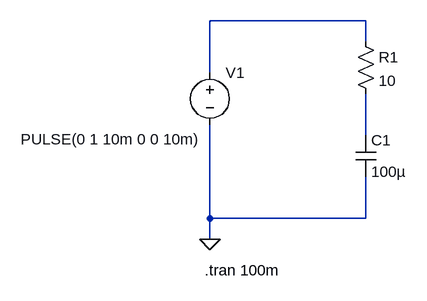
[diagram p0: schematic s-311_2.asc]
s-311_2.asc, the LTspice schematic file:
Version 4
SHEET 1 880 680
WIRE 304 48 64 48
WIRE 304 80 304 48
WIRE 64 128 64 48
WIRE 304 224 304 160
WIRE 64 352 64 208
WIRE 304 352 304 288
WIRE 304 352 64 352
WIRE 64 384 64 352
FLAG 64 384 0
SYMBOL voltage 64 112 R0
WINDOW 3 -291 118 Left 2
WINDOW 123 0 0 Left 0
WINDOW 39 0 0 Left 0
SYMATTR InstName V1
SYMATTR Value PULSE(0 1 10m 0 0 10m)
SYMBOL res 288 64 R0
SYMATTR InstName R1
SYMATTR Value 10
SYMBOL cap 288 224 R0
SYMATTR InstName C1
SYMATTR Value 100µ
TEXT 56 432 Left 2 !.tran 100m

The netlist it stands for:
* s-311_2.asc
V1 N001 0 PULSE(0 1 10m 0 0 10m)
R1 N001 N002 10
C1 N002 0 100µ
.tran 100m
.backanno
.end

* Results of the author's LTspice run, read from the files saved beside the schematic
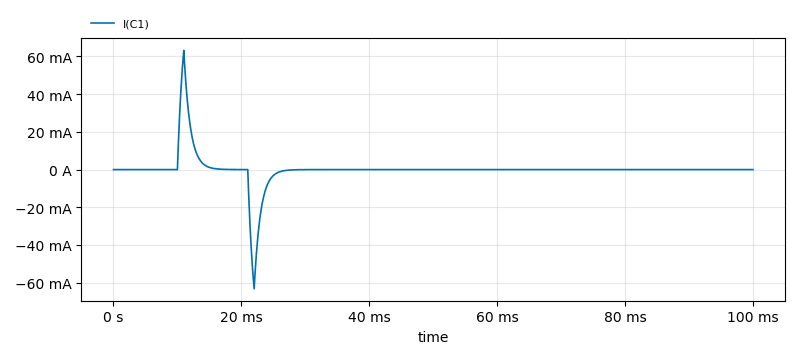
[diagram p1: Transient Analysis of s-311_2.asc, plotted from the saved traces]
* Transient Analysis, 1 run:
*   I(C1): min -63.23 mA, max 63.24 mA, average 173.9 nA, rms 8.589 mA, last 0 A